# EAGLE design mainCircuit (EAGLE 9.4.2)
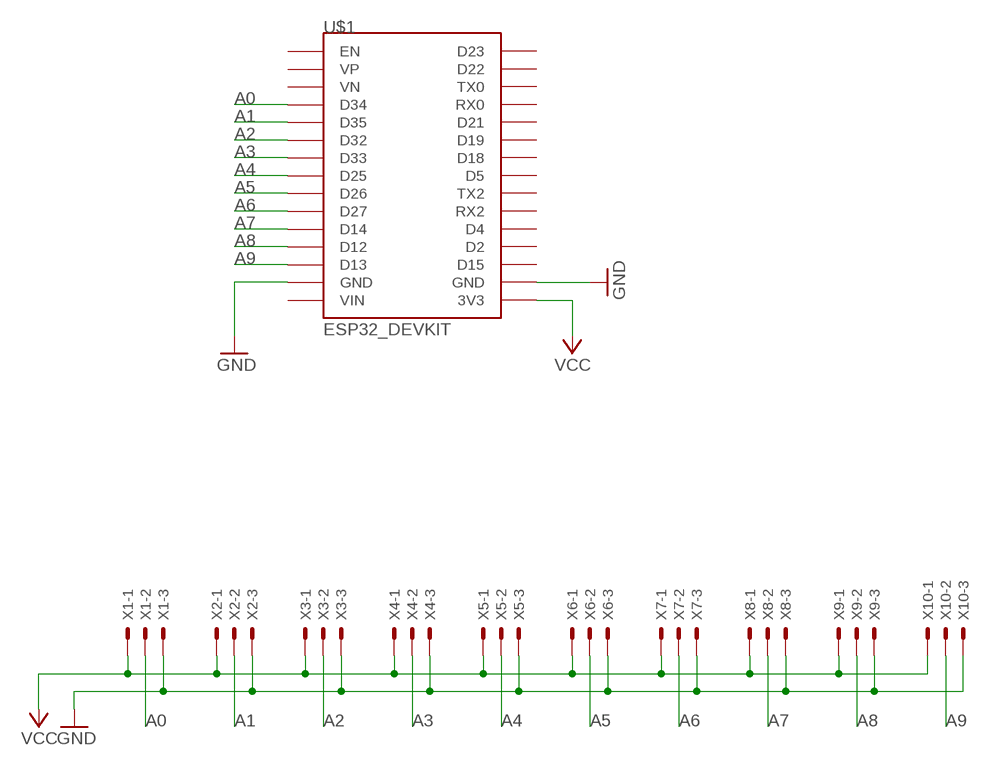
[diagram p0: schematic, sheet 1]

## Parts
U$1  ESP32_DEVKIT  [ESP32_DEVKIT]
X1  JST-XH-03-PIN-LONG-PAD  [JST-XH-03-PACKAGE-LONG-PAD]
X2  JST-XH-03-PIN-LONG-PAD  [JST-XH-03-PACKAGE-LONG-PAD]
X3  JST-XH-03-PIN-LONG-PAD  [JST-XH-03-PACKAGE-LONG-PAD]
X4  JST-XH-03-PIN-LONG-PAD  [JST-XH-03-PACKAGE-LONG-PAD]
X5  JST-XH-03-PIN-LONG-PAD  [JST-XH-03-PACKAGE-LONG-PAD]
X6  JST-XH-03-PIN-LONG-PAD  [JST-XH-03-PACKAGE-LONG-PAD]
X7  JST-XH-03-PIN-LONG-PAD  [JST-XH-03-PACKAGE-LONG-PAD]
X8  JST-XH-03-PIN-LONG-PAD  [JST-XH-03-PACKAGE-LONG-PAD]
X9  JST-XH-03-PIN-LONG-PAD  [JST-XH-03-PACKAGE-LONG-PAD]
X10  JST-XH-03-PIN-LONG-PAD  [JST-XH-03-PACKAGE-LONG-PAD]

## Nets
A0: U$1.D34 X1.2
A1: U$1.D35 X2.2
A2: U$1.D32 X3.2
A3: U$1.D33 X4.2
A4: U$1.D25 X5.2
A5: U$1.D26 X6.2
A6: U$1.D27 X7.2
A7: U$1.D14 X8.2
A8: U$1.D12 X9.2
A9: U$1.D13 X10.2
GND: U$1.GND@1(GND) U$1.GND@2(GND) X1.3 X2.3 X3.3 X4.3 X5.3 X6.3 X7.3 X8.3 X9.3 X10.3
VCC: U$1.3V3 X1.1 X2.1 X3.1 X4.1 X5.1 X6.1 X7.1 X8.1 X9.1 X10.1
Unconnected: U$1.D2 U$1.D4 U$1.D5 U$1.D15 U$1.D18 U$1.D19 U$1.D21 U$1.D22 U$1.D23 U$1.EN U$1.RX0 U$1.RX2 U$1.TX0 U$1.TX2 U$1.VIN U$1.VN U$1.VP

## Library data of the parts
U$1 = DOIT_ESP32_DEVKIT:ESP32_DEVKIT: ESP32 DEVKIT BOARD
X1-X10 = Rembrandt Electronics - JST XH Connectors v1-0:JST-XH-03-PIN: JST XH Connector 2 Pin Wire to board connector. Pitch: 2,54 mm, (0.100") Number of pins: 3 Created by Rembrandt Electronics www.rembrandtelectronics.com

## Board
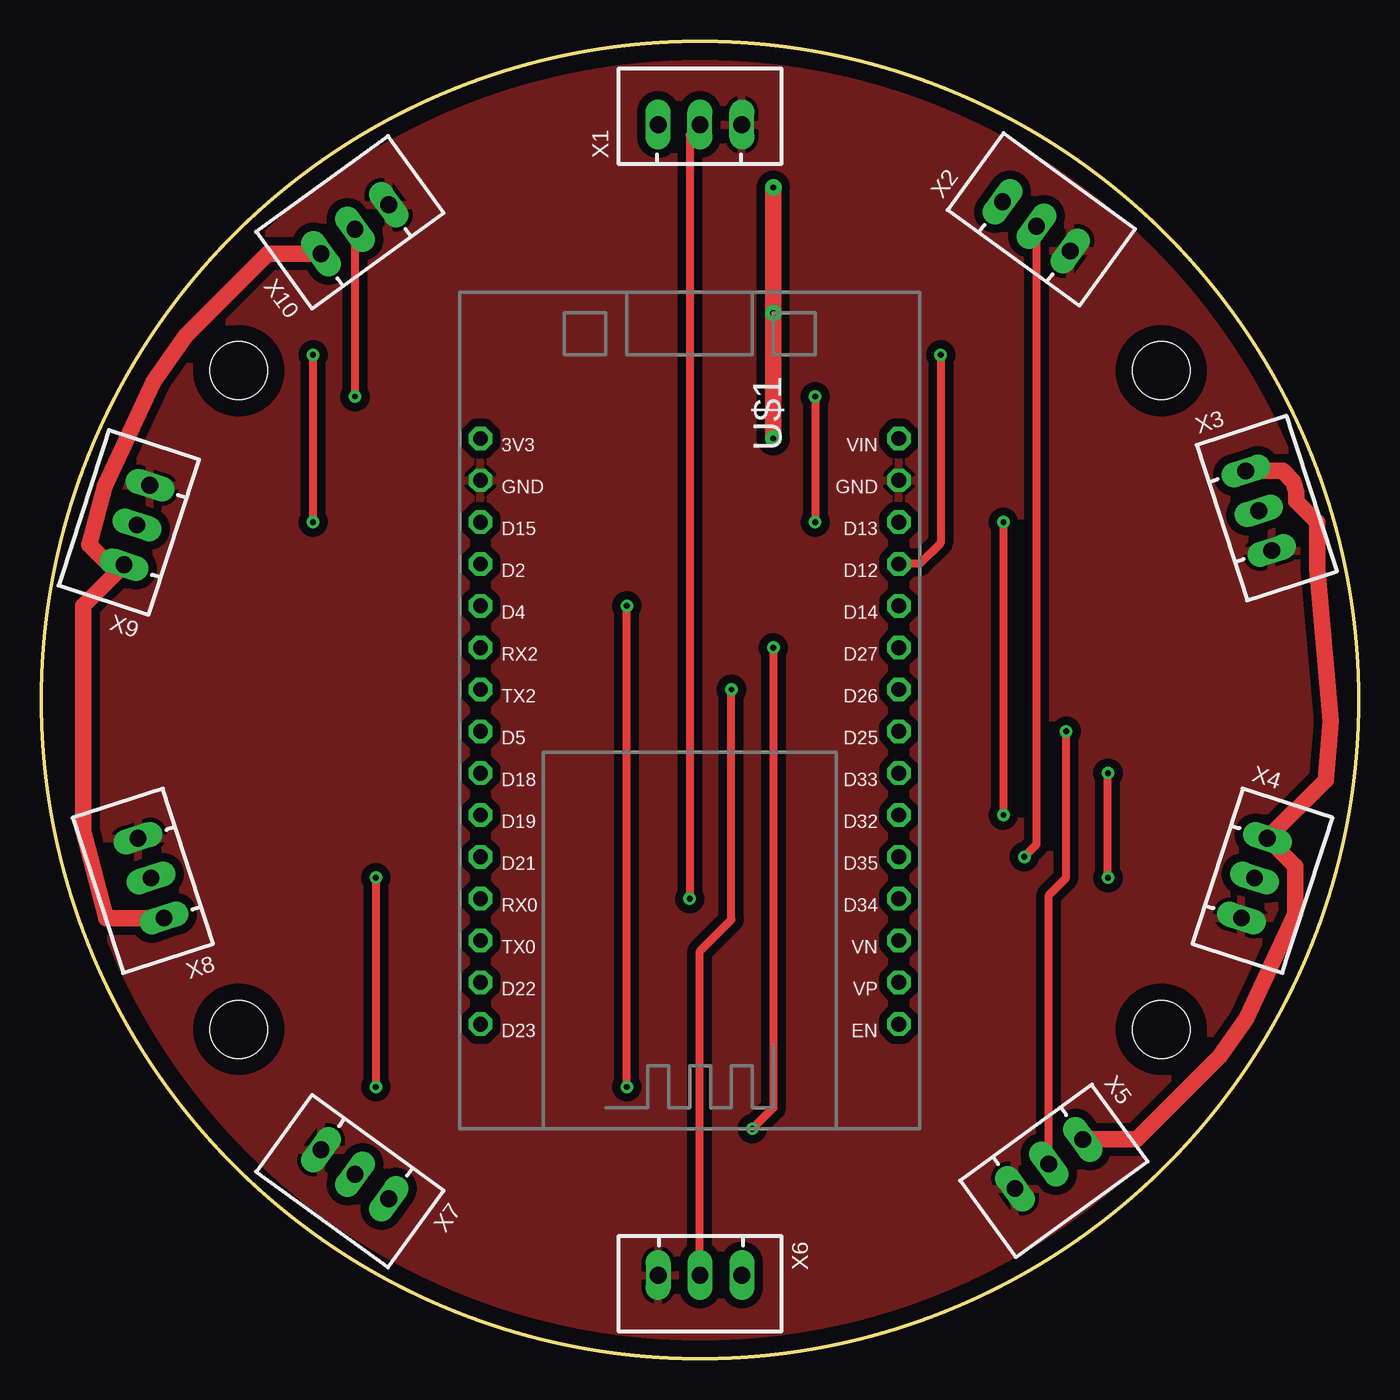
[diagram p1: board, top side]
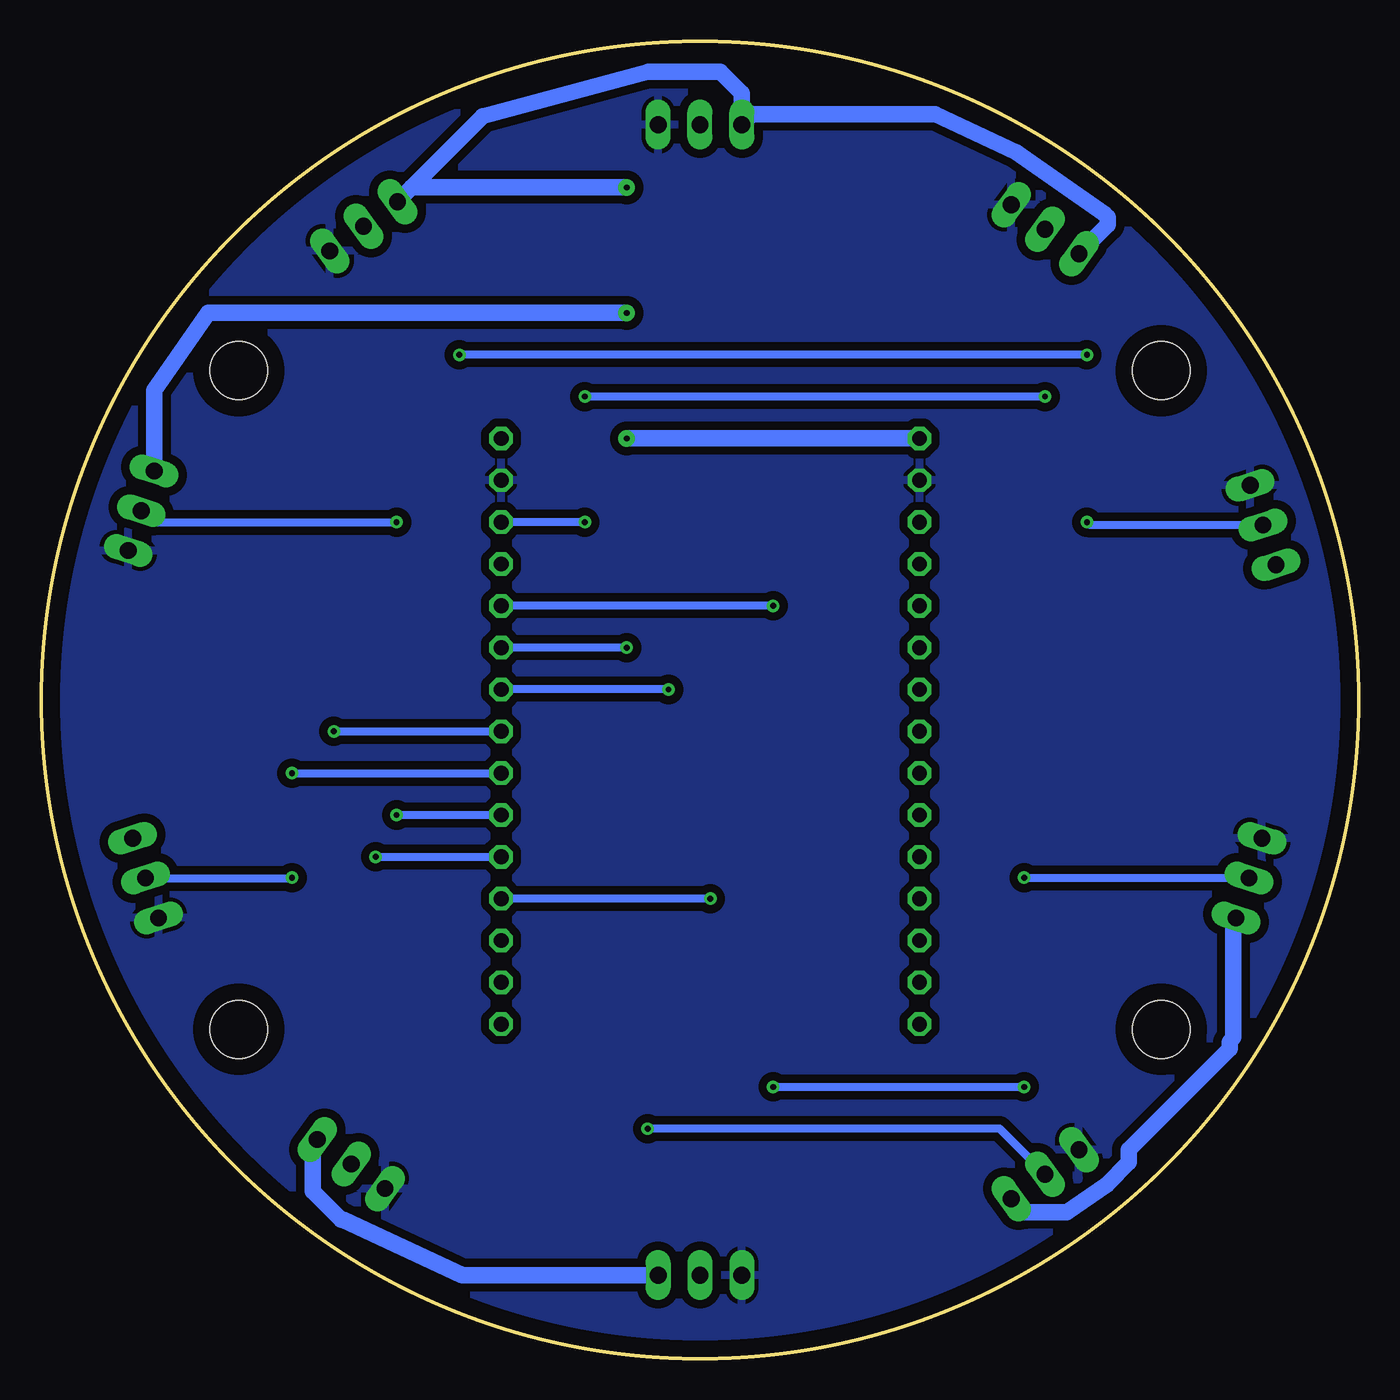
[diagram p2: board, bottom side, seen from below]

Size 80 x 80 mm. Coordinates in mm from the lower left corner, seen from the top.
Outline: circle at 40,40 radius 40
Copper layers (1*16): Top 0.035mm / dielectric 1.5mm / Bottom 0.035mm
Design rules "default *": minimum track width 6mil, minimum drill 0.35mm, track to track 20mil, track to pad 20mil, pad to pad 6mil, via to via 6mil, smd to smd 6mil, copper to edge 40mil, drill to drill 6mil, minimum pad ring 10mil, minimum via ring 8mil, stop-mask expansion 4mil, vias tented up to drill 0mil, thermal gap 10mil
Holes 3.5 mm at 12,60 12,20 68,20 68,60

### Footprints (pad centres in the part's own frame; a part is rotated, then mirrored left to right if it is on the bottom)
ESP32_DEVKIT = drill 0.9 pad 1.422 octagon: 3V3 11.43,-17.78; D2 11.43,-10.16; D4 11.43,-7.62; D5 11.43,0; D12 -13.97,-10.16; D13 -13.97,-12.7; D14 -13.97,-7.62; D15 11.43,-12.7; D18 11.43,2.54; D19 11.43,5.08; D21 11.43,7.62; D22 11.43,15.24; D23 11.43,17.78; D25 -13.97,0; D26 -13.97,-2.54; D27 -13.97,-5.08; D32 -13.97,5.08; D33 -13.97,2.54; D34 -13.97,10.16; D35 -13.97,7.62; EN -13.97,17.78; GND@1 -13.97,-15.24; GND@2 11.43,-15.24; RX0 11.43,10.16; RX2 11.43,-5.08; TX0 11.43,12.7; TX2 11.43,-2.54; VIN -13.97,-17.78; VN -13.97,12.7; VP -13.97,15.24
JST-XH-03-PACKAGE-LONG-PAD = drill 1.016 long: 1 -2.54,0; 2 0,0; 3 2.54,0

### Placement (x,y rotation side)
U$1  38.1,38.1 180 top
X1  40,74.93 0 top
X2  60.42,68.76 324 top
X3  73.93,51.49 288 top
X4  73.66,29.19 252 top
X5  61.18,11.83 216 top
X6  40,5.08 180 top
X7  19.05,11.21 144 top
X8  6.67,29.19 108 top
X9  5.81,50.62 72 top
X10  19.05,68.58 36 top

### Tracks (layer width: path | path; a pad name or v marks a point on that pad's centre or on a via)
A0  (via drill 0.35)
  Top 0.152: X1.2 39.37,74.3
  Top 0.5: 39.37,74.3 v39.37,27.94
  Bottom 0.5: v39.37,27.94 U$1.D34
A1  (via drill 0.35)
  Top 0.5: X2.2 60.42,31.21 v59.69,30.48
  Bottom 0.5: v59.69,30.48 U$1.D35
A2  (via drill 0.35)
  Top 0.5: v58.42,50.8 v58.42,33.02
  Bottom 0.5: X3.2 73.23,50.8 v58.42,50.8 | v58.42,33.02 U$1.D32
  other vias: 52.07,33.02
A3  (via drill 0.35)
  Top 0.5: v64.77,29.21 v64.77,35.56
  Bottom 0.5: X4.2 64.79,29.19 v64.77,29.21 | v64.77,35.56 U$1.D33
A4  (via drill 0.35)
  Top 0.5: X5.2 61.18,28.16 62.23,29.21 v62.23,38.1
  Bottom 0.5: v62.23,38.1 U$1.D25
A5  (via drill 0.35)
  Top 0.5: X6.2 40,24.76 41.91,26.67 v41.91,40.64
  Bottom 0.5: v41.91,40.64 U$1.D26
A6  (via drill 0.35)
  Top 0.5: v43.18,13.97 44.45,15.24 v44.45,43.18
  Bottom 0.5: X7.2 21.82,13.97 v43.18,13.97 | v44.45,43.18 U$1.D27
A7  (via drill 0.35)
  Top 0.5: v20.32,29.21 v20.32,16.51 | v35.56,16.51 v35.56,45.72
  Bottom 0.5: X8.2 20.3,29.19 v20.32,29.21 | v35.56,16.51 v20.32,16.51 | v35.56,45.72 U$1.D14
  other vias: 52.07,45.72
A8  (via drill 0.35, 0.35 pad 0.5)
  Top 0.5: v16.51,50.8 v16.51,60.96 | v54.61,60.96 54.61,49.53 53.34,48.26 U$1.D12
  Bottom 0.5: X9.2 16.33,50.62 v16.51,50.8 | v16.51,60.96 v54.61,60.96
A9  (via drill 0.35)
  Top 0.5: X10.2 v19.05,58.42 | v46.99,58.42 v46.99,50.8
  Bottom 0.5: v19.05,58.42 v46.99,58.42 | v46.99,50.8 U$1.D13
GND
  pour Top: 39.37,80.01 arc90 0,40.64 arc90 40.64,0 arc90 80.01,39.37 arc90
  pour Bottom: 39.37,80.01 arc90 0,40.64 arc90 40.64,0 arc90 80.01,39.37 arc90
VCC  (via drill 0.35 pad 1)
  Top 1: v44.45,55.88 v44.45,63.5 v44.45,71.12 | X10.1 13.75,67.09 8.78,62.12 6.84,59.35 3.86,52.97 2.92,49.43 4.14,48.21 X9.1 2.54,45.72 2.54,32.06 3.96,26.74 7.43,26.74 X8.1 | X5.1 66.52,13.32 71.56,18.36 73.17,20.66 76.14,27.03 76.14,29.91 X4.1 77.98,35.14 78.3,38.71 77.49,47.92 77.49,50.78 76.2,52.07 76.2,52.64 76.03,53.26 75.39,53.91 X3.1
  Bottom 1: U$1.3V3 v44.45,55.88 | v44.45,71.12 57.5,71.12 X2.1 53.18,75.44 43.13,78.13 38.76,78.13 37.46,76.83 X1.1 36.84,75.55 25.7,75.55 20.8,73.26 15.46,69.53 15.24,69.3 15.24,68.84 X10.1 | X8.1 7.62,26.6 7.62,19.54 7.85,19.21 7.85,18.82 13.97,12.7 13.97,11.92 15.31,10.58 17.72,8.89 20.28,8.89 X7.1 | X6.1 54.42,5.08 61.65,8.45 61.79,8.45 63.5,10.16 63.5,13.05 X5.1 | v44.45,63.5 69.85,63.5 73.14,58.8 X3.1